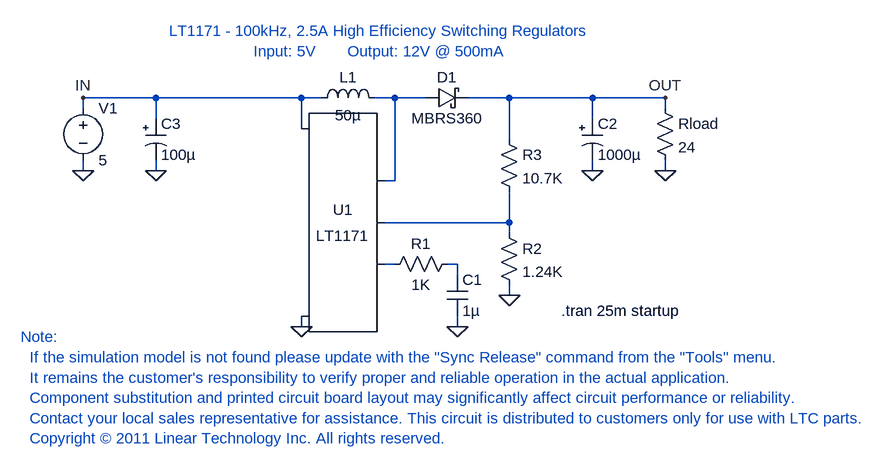
[diagram p0: schematic LT1171_TA01.asc]
LT1171_TA01.asc, the LTspice schematic file:
Version 4
SHEET 1 2852 1464
WIRE 1600 896 1488 896
WIRE 1824 896 1600 896
WIRE 1856 896 1824 896
WIRE 1968 896 1936 896
WIRE 2016 896 1968 896
WIRE 2144 896 2080 896
WIRE 2272 896 2144 896
WIRE 2384 896 2272 896
WIRE 1488 912 1488 896
WIRE 2384 912 2384 896
WIRE 1600 928 1600 896
WIRE 2272 928 2272 896
WIRE 1824 944 1824 896
WIRE 2144 960 2144 896
WIRE 1488 1008 1488 992
WIRE 1600 1008 1600 992
WIRE 2272 1008 2272 992
WIRE 2384 1008 2384 992
WIRE 1968 1024 1968 896
WIRE 1968 1024 1952 1024
WIRE 2144 1088 2144 1040
WIRE 2144 1088 1952 1088
WIRE 2144 1104 2144 1088
WIRE 1968 1152 1952 1152
WIRE 2064 1152 2048 1152
WIRE 2064 1168 2064 1152
WIRE 2144 1200 2144 1184
WIRE 1824 1248 1824 1232
WIRE 2064 1248 2064 1232
FLAG 1488 1008 0
FLAG 1600 1008 0
FLAG 1824 1248 0
FLAG 2064 1248 0
FLAG 2384 1008 0
FLAG 2272 1008 0
FLAG 2144 1200 0
FLAG 2384 896 OUT
FLAG 1488 896 IN
SYMBOL VOLTAGE 1488 896 R0
SYMATTR InstName V1
SYMATTR Value 5
SYMATTR SpiceLine Rser=0.1
SYMBOL CAP 2048 1168 R0
SYMATTR InstName C1
SYMATTR Value 1µ
SYMBOL RES 1952 1168 R270
WINDOW 0 32 56 VTop 2
WINDOW 3 0 56 VBottom 2
SYMATTR InstName R1
SYMATTR Value 1K
SYMBOL RES 2128 1088 R0
SYMATTR InstName R2
SYMATTR Value 1.24K
SYMBOL RES 2128 944 R0
SYMATTR InstName R3
SYMATTR Value 10.7K
SYMBOL schottky 2016 912 R270
WINDOW 0 32 32 VTop 2
WINDOW 3 0 32 VBottom 2
SYMATTR InstName D1
SYMATTR Value MBRS360
SYMBOL ind 1840 912 R270
WINDOW 0 32 56 VTop 2
WINDOW 3 5 56 VBottom 2
SYMATTR InstName L1
SYMATTR Value 50µ
SYMATTR SpiceLine Rser=0.02 Rpar=5000
SYMBOL polcap 2256 928 R0
SYMATTR InstName C2
SYMATTR Value 1000µ
SYMATTR SpiceLine Rser=0.05
SYMBOL polcap 1584 928 R0
SYMATTR InstName C3
SYMATTR Value 100µ
SYMATTR SpiceLine Rser=0.05
SYMBOL RES 2368 896 R0
SYMATTR InstName Rload
SYMATTR Value 24
SYMBOL PowerProducts\\LT1171 1824 1088 R0
SYMATTR InstName U1
TEXT 2224 1224 Left 2 !.tran 25m startup
TEXT 1944 840 Bottom 2 ;LT1171 - 100kHz, 2.5A High Efficiency Switching Regulators\nInput: 5V       Output: 12V @ 500mA
TEXT 1392 1264 Left 2 ;Note:\n  If the simulation model is not found please update with the "Sync Release" command from the "Tools" menu.\n  It remains the customer's responsibility to verify proper and reliable operation in the actual application.\n  Component substitution and printed circuit board layout may significantly affect circuit performance or reliability.\n  Contact your local sales representative for assistance. This circuit is distributed to customers only for use with LTC parts.\n  Copyright © 2011 Linear Technology Inc. All rights reserved.

The netlist it stands for:
* LT1171_TA01.asc
V1 IN 0 5 Rser=0.1
C1 N004 0 1µ
R1 N003 N004 1K
R2 N002 0 1.24K
R3 OUT N002 10.7K
D1 N001 OUT MBRS360
L1 IN N001 50µ Rser=0.02 Rpar=5000
C2 OUT 0 1000µ Rser=0.05
C3 IN 0 100µ Rser=0.05
Rload OUT 0 24
XU1 N003 N002 0 N001 IN LT1171
.model D D
.lib standard.dio
.tran 25m startup
* LT1171 - 100kHz, 2.5A High Efficiency Switching Regulators
* Input: 5V       Output: 12V @ 500mA
* Note:
*   If the simulation model is not found please update with the "Sync Release" command from the "Tools" menu.
*   It remains the customer's responsibility to verify proper and reliable operation in the actual application.
*   Component substitution and printed circuit board layout may significantly affect circuit performance or reliability.
*   Contact your local sales representative for assistance. This circuit is distributed to customers only for use with LTC parts.
*   Copyright © 2011 Linear Technology Inc. All rights reserved.
.lib LT1171.sub
.backanno
.end